# Altium schematic sheet 04.MOSFET.SchDoc: ARES_R06_Power
size A4; CompanyName: HIGEN; DrawnBy: 212115; Revision: V0.21; SheetNumber: 4; SheetTotal: 5; DrawingNumber: 임시도면
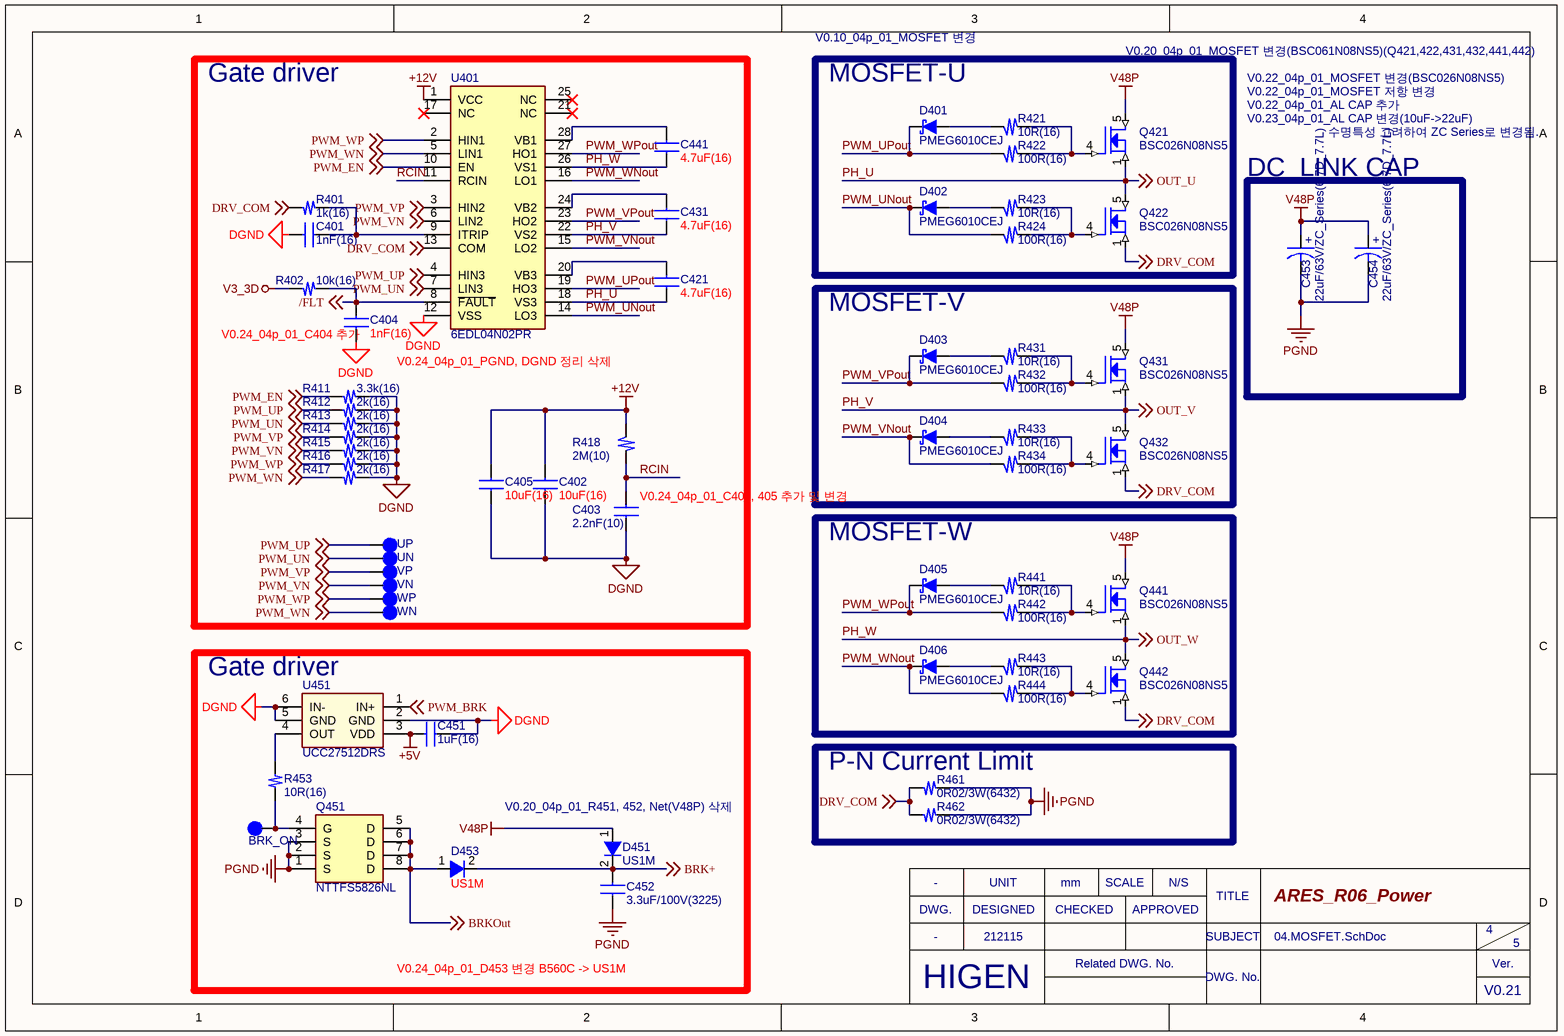
[diagram p0: 04.MOSFET.SchDoc]

## Parts
BRK_ON  TP  [TP-SMD]  (value not drawn)
C401  1nF(16)  [C-1608S]
C402  10uF(16)  [C-1608S]
C403  2.2nF(10)  [C-1005S]
C404  1nF(16)  [C-1608S]
C405  10uF(16)  [C-1608S]
C421  4.7uF(16)  [C-1608S]
C431  4.7uF(16)  [C-1608S]
C441  4.7uF(16)  [C-1608S]
C451  1uF(16)  [C-1608S]
C452  3.3uF/100V(3225)  [C-3225]
C453  22uF/63V/ZC_Series(6.7D_7.7L)  [EC-F80]
C454  22uF/63V/ZC_Series(6.7D_7.7L)  [EC-F80]
D401  PMEG6010CEJ  [SOD-323]
D402  PMEG6010CEJ  [SOD-323]
D403  PMEG6010CEJ  [SOD-323]
D404  PMEG6010CEJ  [SOD-323]
D405  PMEG6010CEJ  [SOD-323]
D406  PMEG6010CEJ  [SOD-323]
D451  US1M  [SMA]
D453  US1M  [SMA]
Q421  BSC026N08NS5  [PG-TDSON-8 FL]
Q422  BSC026N08NS5  [PG-TDSON-8 FL]
Q431  BSC026N08NS5  [PG-TDSON-8 FL]
Q432  BSC026N08NS5  [PG-TDSON-8 FL]
Q441  BSC026N08NS5  [PG-TDSON-8 FL]
Q442  BSC026N08NS5  [PG-TDSON-8 FL]
Q451  NTTFS5826NL  [WDFN-8]
R401  1k(16)  [R-1608]
R402  10k(16)  [R-1608S]
R411  3.3k(16)  [R-1608S]
R412  2k(16)  [R-1608S]
R413  2k(16)  [R-1608S]
R414  2k(16)  [R-1608S]
R415  2k(16)  [R-1608S]
R416  2k(16)  [R-1608S]
R417  2k(16)  [R-1608S]
R418  2M(10)  [R-1005S]
R421  10R(16)  [R-1608S]
R422  100R(16)  [R-1608S]
R423  10R(16)  [R-1608S]
R424  100R(16)  [R-1608S]
R431  10R(16)  [R-1608S]
R432  100R(16)  [R-1608S]
R433  10R(16)  [R-1608S]
R434  100R(16)  [R-1608S]
R441  10R(16)  [R-1608S]
R442  100R(16)  [R-1608S]
R443  10R(16)  [R-1608S]
R444  100R(16)  [R-1608S]
R453  10R(16)  [R-1608S]
R461  0R02/3W(6432)  [R-6432]
R462  0R02/3W(6432)  [R-6432]
U401  6EDL04N02PR  [TSSOP-28]
U451  UCC27512DRS  [WSON-6]
UN  TP  [TP-SMD]  (value not drawn)
UP  TP  [TP-SMD]  (value not drawn)
VN  TP  [TP-SMD]  (value not drawn)
VP  TP  [TP-SMD]  (value not drawn)
WN  TP  [TP-SMD]  (value not drawn)
WP  TP  [TP-SMD]  (value not drawn)

## Blocks framed on the sheet
Gate driver: C401-C405 C421 C431 C441 R401 R402 R411-R418 U401 UN UP VN VP WN WP
MOSFET-U: D401 D402 Q421 Q422 R421-R424
DC_LINK CAP: C453 C454
MOSFET-V: D403 D404 Q431 Q432 R431-R434
MOSFET-W: D405 D406 Q441 Q442 R441-R444
Gate driver: BRK_ON C451 C452 D451 D453 Q451 R453 U451
P-N Current Limit: R461 R462

## Nets
+5V: C451.1 U451.3(VDD)
+12V: C402.1 C405.1 R418.2 U401.1(VCC)
DGND: C401.1 C402.2 C403.1 C404.1 C405.2 C451.2 R411.2(P2) R412.1(P1) R413.1(P1) R414.1(P1) R415.1(P1) R416.2(P2) R417.2(P2) U401.12(VSS) U451.2(GND) U451.5(GND) U451.6(IN-)
PGND: C452.1 C453.2 C454.2 Q451.1(S) Q451.2(S) Q451.3(S) R461.1(P1) R462.1(P1)
V3_3D: R402.1(P1)
V48P: C453.1 C454.1 D451.1(A) Q421.5(DRAIN) Q431.5(DRAIN) Q441.5(DRAIN)
/FLT: C404.2 R402.2(P2) U401.8(~{FAULT}) ; off-sheet /FLT
BRK+: C452.2 D451.2(K) D453.2(K) ; off-sheet BRK+
BRKOut: D453.1(A) Q451.5(D) Q451.6(D) Q451.7(D) Q451.8(D) ; off-sheet BRKOut
DRV_COM: Q422.1(SOURCE) Q432.1(SOURCE) Q442.1(SOURCE) R401.1(P1) R461.2(P2) R462.2(P2) U401.13(COM) ; off-sheet DRV_COM
PH_U: C421.2 Q421.1(SOURCE) Q422.5(DRAIN) U401.18(VS3) ; off-sheet OUT_U  [also labelled OUT_U]
PH_V: C431.1 Q431.1(SOURCE) Q432.5(DRAIN) U401.22(VS2) ; off-sheet OUT_V  [also labelled OUT_V]
PH_W: C441.1 Q441.1(SOURCE) Q442.5(DRAIN) U401.26(VS1) ; off-sheet OUT_W  [also labelled OUT_W]
PWM_BRK: U451.1(IN+) ; off-sheet PWM_BRK
PWM_EN: R411.1(P1) U401.10(EN) ; off-sheet PWM_EN
PWM_UN: R413.2(P2) U401.7(LIN3) UN.1 ; off-sheet PWM_UN
PWM_UNout: D402.2(K) R424.2 U401.14(LO3)
PWM_UP: R412.2(P2) U401.4(HIN3) UP.1 ; off-sheet PWM_UP
PWM_UPout: D401.2(K) R422.2 U401.19(HO3)
PWM_VN: R415.2(P2) U401.6(LIN2) VN.1 ; off-sheet PWM_VN
PWM_VNout: D404.2(K) R434.2 U401.15(LO2)
PWM_VP: R414.2(P2) U401.3(HIN2) VP.1 ; off-sheet PWM_VP
PWM_VPout: D403.2(K) R432.2 U401.23(HO2)
PWM_WN: R417.1(P1) U401.5(LIN1) WN.1 ; off-sheet PWM_WN
PWM_WNout: D406.2(K) R444.2 U401.16(LO1)
PWM_WP: R416.1(P1) U401.2(HIN1) WP.1 ; off-sheet PWM_WP
PWM_WPout: D405.2(K) R442.2 U401.27(HO1)
RCIN: C403.2 R418.1 U401.11(RCIN)
NetBRK_ON_1: BRK_ON.1 Q451.4(G) R453.1(P1)
NetC401_2: C401.2 R401.2(P2) U401.9(ITRIP)
NetC421_1: C421.1 U401.20(VB3)
NetC431_2: C431.2 U401.24(VB2)
NetC441_2: C441.2 U401.28(VB1)
NetD401_1: D401.1(A) R421.2
NetD402_1: D402.1(A) R423.2
NetD403_1: D403.1(A) R431.2
NetD404_1: D404.1(A) R433.2
NetD405_1: D405.1(A) R441.2
NetD406_1: D406.1(A) R443.2
NetQ421_4: Q421.4(GATE) R421.1 R422.1
NetQ422_4: Q422.4(GATE) R423.1 R424.1
NetQ431_4: Q431.4(GATE) R431.1 R432.1
NetQ432_4: Q432.4(GATE) R433.1 R434.1
NetQ441_4: Q441.4(GATE) R441.1 R442.1
NetQ442_4: Q442.4(GATE) R443.1 R444.1
NetR453_2: R453.2(P2) U451.4(OUT)

Not connected (* = marked no-connect by the designer): U401 17(NC)* 21(NC)* 25(NC)*

## Notes on the sheet
- V0.10_04p_01_MOSFET 변경
- V0.20_04p_01_MOSFET 변경(BSC061N08NS5)(Q421,422,431,432,441,442)
- V0.22_04p_01_MOSFET 변경(BSC026N08NS5)
- V0.22_04p_01_MOSFET 저항 변경
- V0.22_04p_01_AL CAP 추가
- V0.23_04p_01_AL CAP 변경(10uF->22uF)
- 수명특성 고려하여 ZC Series로 변경됨.
- (near C404) V0.24_04p_01_C404 추가
- V0.24_04p_01_PGND, DGND 정리 삭제
- (near C403) V0.24_04p_01_C402, 405 추가 및 변경
- (near D451) V0.20_04p_01_R451, 452, Net(V48P) 삭제
- V0.24_04p_01_D453 변경 B560C -> US1M
- -
- DWG.
- UNIT
- DESIGNED
- mm
- CHECKED
- SCALE
- APPROVED
- N/S
- TITLE
- HIGEN
- Related DWG. No.
- SUBJECT
- DWG. No.
- Ver.
- (in symbol CAP_Pol) +

## Library data of the parts
BRK_ON UN UP VN VP WN WP = 2H_TestPointThroughHole: Mfr: Keystone Electronics; MfrNum: 5002; TIIntPartnumber: 2H0026; DescriptiveText: Testpoint Miniature Through Hole; Vendor: Digikey; Cost100: 0.163; Cost10K: 0.10; PartName: TestPointThroughHole
C401-C405 C421 C431 C441 C452 = CAP_NP
C451 = Cap_NP
C453 C454 = CAP_Pol
D401-D406 = Diode_schottky
D451 D453 = Diode
Q421 Q422 Q431 Q432 Q441 Q442 = MOSFET N
R401 R402 R411-R418 R421-R424 R431-R434 R441-R444 R453 R461 R462 = Res